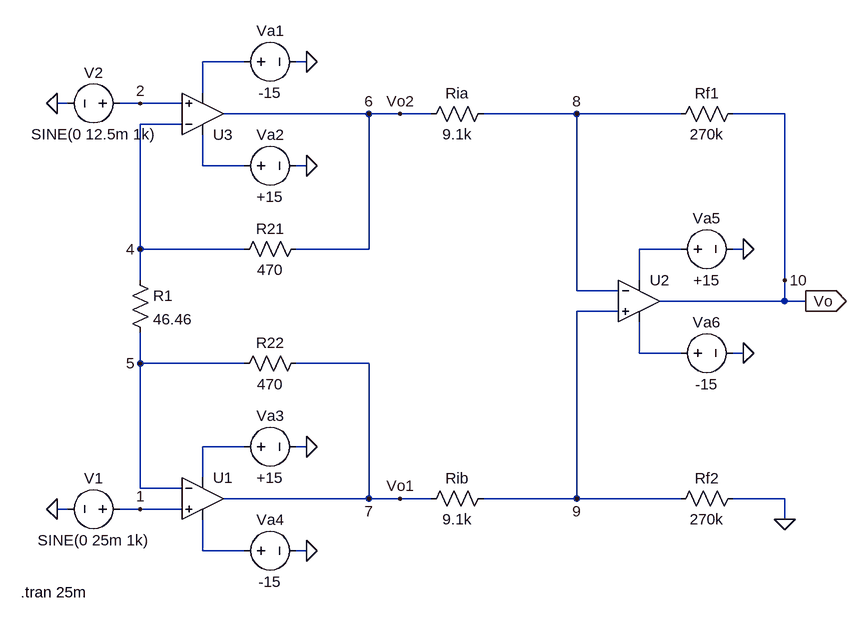
[diagram p0: schematic Run_1_D.asc]
Run_1_D.asc, the LTspice schematic file:
Version 4
SHEET 1 880 680
WIRE -112 -272 -176 -272
WIRE -16 -272 -32 -272
WIRE -176 -224 -176 -272
WIRE -384 -208 -400 -208
WIRE -272 -208 -304 -208
WIRE -208 -208 -272 -208
WIRE 80 -192 -144 -192
WIRE 128 -192 80 -192
WIRE 176 -192 128 -192
WIRE 400 -192 256 -192
WIRE 560 -192 400 -192
WIRE 720 -192 640 -192
WIRE -208 -176 -272 -176
WIRE -176 -112 -176 -160
WIRE -112 -112 -176 -112
WIRE -16 -112 -32 -112
WIRE -272 16 -272 -176
WIRE -112 16 -272 16
WIRE 80 16 80 -192
WIRE 80 16 -32 16
WIRE 560 16 496 16
WIRE 656 16 640 16
WIRE -272 64 -272 16
WIRE 496 64 496 16
WIRE 720 64 720 -192
WIRE 400 80 400 -192
WIRE 464 80 400 80
WIRE 720 96 720 64
WIRE 720 96 528 96
WIRE 752 96 720 96
WIRE 464 112 400 112
WIRE 496 176 496 128
WIRE 560 176 496 176
WIRE 656 176 640 176
WIRE -272 192 -272 144
WIRE -112 192 -272 192
WIRE 80 192 -32 192
WIRE -112 320 -176 320
WIRE -16 320 -32 320
WIRE -176 368 -176 320
WIRE -272 384 -272 192
WIRE -208 384 -272 384
WIRE 80 400 80 192
WIRE 80 400 -144 400
WIRE 128 400 80 400
WIRE 176 400 128 400
WIRE 400 400 400 112
WIRE 400 400 256 400
WIRE 560 400 400 400
WIRE 720 400 640 400
WIRE -384 416 -400 416
WIRE -272 416 -304 416
WIRE -208 416 -272 416
WIRE 720 432 720 400
WIRE -176 480 -176 432
WIRE -112 480 -176 480
WIRE -16 480 -32 480
FLAG -16 -112 0
FLAG -16 -272 0
FLAG -16 480 0
FLAG -16 320 0
FLAG 656 176 0
FLAG 656 16 0
FLAG 752 96 Vo
IOPIN 752 96 Out
FLAG 720 432 0
FLAG -272 416 1
FLAG -272 -208 2
FLAG -272 16 4
FLAG -272 192 5
FLAG 400 -192 8
FLAG 400 400 9
FLAG 720 64 10
FLAG 80 -192 6
FLAG 80 400 7
FLAG 128 -192 Vo2
FLAG 128 400 Vo1
FLAG -400 416 0
FLAG -400 -208 0
SYMBOL voltage -128 -272 R270
WINDOW 0 32 56 VTop 2
WINDOW 3 -32 56 VBottom 2
WINDOW 123 0 0 Left 0
WINDOW 39 0 0 Left 0
SYMATTR InstName Va1
SYMATTR Value -15
SYMBOL voltage -128 -112 R270
WINDOW 0 32 56 VTop 2
WINDOW 3 -32 56 VBottom 2
WINDOW 123 0 0 Left 0
WINDOW 39 0 0 Left 0
SYMATTR InstName Va2
SYMATTR Value +15
SYMBOL res -288 48 R0
SYMATTR InstName R1
SYMATTR Value 46.46
SYMBOL res 272 -208 R90
WINDOW 0 0 56 VBottom 2
WINDOW 3 32 56 VTop 2
SYMATTR InstName Ria
SYMATTR Value 9.1k
SYMBOL res -16 0 R90
WINDOW 0 0 56 VBottom 2
WINDOW 3 32 56 VTop 2
SYMATTR InstName R21
SYMATTR Value 470
SYMBOL res -16 176 R90
WINDOW 0 0 56 VBottom 2
WINDOW 3 32 56 VTop 2
SYMATTR InstName R22
SYMATTR Value 470
SYMBOL OpAmps\\UniversalOpamp2 -176 400 R0
SYMATTR InstName U1
SYMBOL voltage -128 320 R270
WINDOW 0 32 56 VTop 2
WINDOW 3 -32 56 VBottom 2
WINDOW 123 0 0 Left 0
WINDOW 39 0 0 Left 0
SYMATTR InstName Va3
SYMATTR Value +15
SYMBOL voltage -128 480 R270
WINDOW 0 32 56 VTop 2
WINDOW 3 -32 56 VBottom 2
WINDOW 123 0 0 Left 0
WINDOW 39 0 0 Left 0
SYMATTR InstName Va4
SYMATTR Value -15
SYMBOL res 272 384 R90
WINDOW 0 0 56 VBottom 2
WINDOW 3 32 56 VTop 2
SYMATTR InstName Rib
SYMATTR Value 9.1k
SYMBOL OpAmps\\UniversalOpamp2 496 96 R0
SYMATTR InstName U2
SYMBOL voltage 544 16 R270
WINDOW 0 32 56 VTop 2
WINDOW 3 -32 56 VBottom 2
WINDOW 123 0 0 Left 0
WINDOW 39 0 0 Left 0
SYMATTR InstName Va5
SYMATTR Value +15
SYMBOL voltage 544 176 R270
WINDOW 0 32 56 VTop 2
WINDOW 3 -32 56 VBottom 2
WINDOW 123 0 0 Left 0
WINDOW 39 0 0 Left 0
SYMATTR InstName Va6
SYMATTR Value -15
SYMBOL res 656 -208 R90
WINDOW 0 0 56 VBottom 2
WINDOW 3 32 56 VTop 2
SYMATTR InstName Rf1
SYMATTR Value 270k
SYMBOL res 656 384 R90
WINDOW 0 0 56 VBottom 2
WINDOW 3 32 56 VTop 2
SYMATTR InstName Rf2
SYMATTR Value 270k
SYMBOL OpAmps\\UniversalOpamp2 -176 -192 M180
SYMATTR InstName U3
SYMBOL voltage -288 416 R90
WINDOW 0 -32 56 VBottom 2
WINDOW 3 32 56 VTop 2
WINDOW 123 0 0 Left 0
WINDOW 39 0 0 Left 0
SYMATTR InstName V1
SYMATTR Value SINE(0 25m 1k)
SYMBOL voltage -288 -208 R90
WINDOW 0 -32 56 VBottom 2
WINDOW 3 32 56 VTop 2
WINDOW 123 0 0 Left 0
WINDOW 39 0 0 Left 0
SYMATTR InstName V2
SYMATTR Value SINE(0 12.5m 1k)
TEXT -456 544 Left 2 !.tran 25m

The netlist it stands for:
* Run_1_D.asc
Va1 N001 0 -15
Va2 N002 0 +15
R1 4 5 46.46
Ria 8 Vo2 9.1k
R21 Vo2 4 470
R22 Vo1 5 470
XU1 1 5 N005 N006 Vo1 level.2 Avol=1Meg GBW=10Meg Slew=10Meg ilimit=25m rail=0 Vos=0 phimargin=45 en=0 enk=0 in=0 ink=0 Rin=500Meg  ; pins IN+ IN- V+ V- OUT
Va3 N005 0 +15
Va4 N006 0 -15
Rib 9 Vo1 9.1k
XU2 9 8 N003 N004 10 level.2 Avol=1Meg GBW=10Meg Slew=10Meg ilimit=25m rail=0 Vos=0 phimargin=45 en=0 enk=0 in=0 ink=0 Rin=500Meg  ; pins IN+ IN- V+ V- OUT
Va5 N003 0 +15
Va6 N004 0 -15
Rf1 10 8 270k
Rf2 0 9 270k
XU3 2 4 N002 N001 Vo2 level.2 Avol=1Meg GBW=10Meg Slew=10Meg ilimit=25m rail=0 Vos=0 phimargin=45 en=0 enk=0 in=0 ink=0 Rin=500Meg  ; pins IN+ IN- V+ V- OUT
V1 1 0 SINE(0 25m 1k)
V2 2 0 SINE(0 12.5m 1k)
.tran 25m
.lib UniversalOpamps2.sub
.backanno
.end